# EAGLE schematic Jds-040-Usb-C (EAGLE 9.6.2)
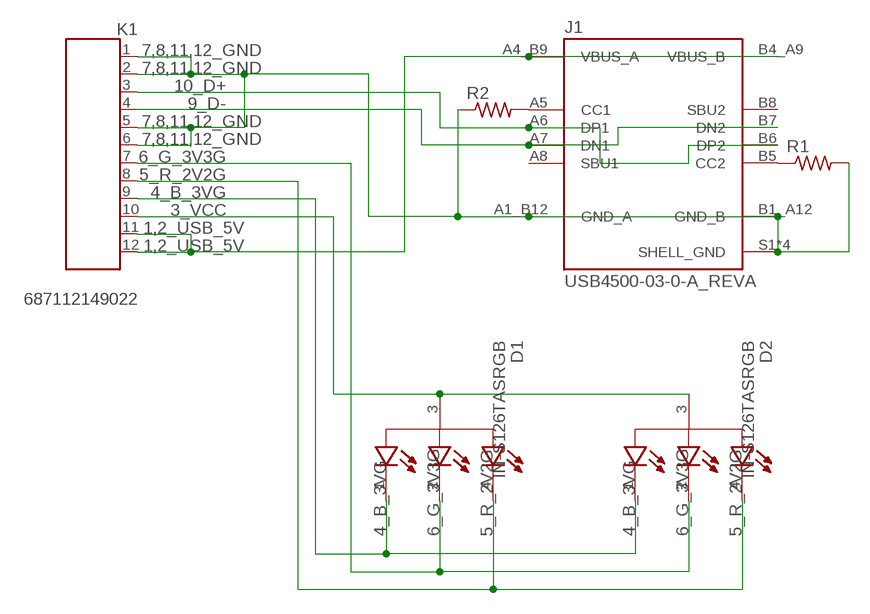
[diagram p0: schematic, sheet 1]

## Parts
D1  IN-S126TASRGB  [LED_IN-S126TASRGB]
D2  IN-S126TASRGB  [LED_IN-S126TASRGB]
J1  USB4500-03-0-A_REVA  [GCT_USB4500-03-0-A_REVA]
K1  687112149022  [687112149022]
R1  5k1  RC0603JR-070RL  [RES_0603]
R2  5k1  RC0603JR-070RL  [RES_0603]

## Nets
1,2_USB_5V: J1.A4_B9(VBUS_A) J1.B4_A9(VBUS_B) K1.11 K1.12
3_VCC: D1.3(COM+) D2.3(COM+) K1.10
4_B_3VG: D1.1(B) D2.1(B) K1.9
5_R_2V2G: D1.4(R) D2.4(R) K1.8
6_G_3V3G: D1.2(G) D2.2(G) K1.7
7,8,11,12_GND: J1.A1_B12(GND_A) J1.B1_A12(GND_B) J1.S1(SHELL_GND) J1.S2(SHELL_GND) J1.S3(SHELL_GND) J1.S4(SHELL_GND) K1.1 K1.2 K1.5 K1.6 R1.2 R2.1
9_D-: J1.A7(DN1) J1.B7(DN2) K1.4
10_D+: J1.A6(DP1) J1.B6(DP2) K1.3
N$1: J1.B5(CC2) R1.1
N$2: J1.A5(CC1) R2.2
Unconnected: J1.A8(SBU1) J1.B8(SBU2)

## Library data of the parts
D1 D2 = IN-S126TASRGB:IN-S126TASRGB: LED RGB CLEAR 1206 SMD R/A Check availability <https://pricing.snapeda.com/parts/IN-S126TASRGB/Inolux/view-part?ref=eda>; AVAILABILITY: In Stock; CHECK_PRICES: https://www.snapeda.com/parts/IN-S126TASRGB/Inolux/view-part/?ref=eda; DESCRIPTION: Red, Green, Blue (RGB) - LED Indication - Discrete 1.6V Red, 2.8V Green, 2.8V Blue 4-SMD; MF: Inolux; MP: IN-S126TASRGB; PACKAGE: 1206 Inolux; PRICE: None; PURCHASE-URL: https://pricing.snapeda.com/search?q=IN-S126TASRGB&ref=eda; SNAPEDA_LINK: https://www.snapeda.com/parts/IN-S126TASRGB/Inolux/view-part/?ref=snap
J1 = USB4500-03-0-A_REVA:USB4500-03-0-A_REVA: Check availability <https://pricing.snapeda.com/parts/USB4500-03-0-A/Global%20Connector%20Technology/view-part?ref=eda>; AVAILABILITY: In Stock; DESCRIPTION: USB-C (USB TYPE-C) USB 2.0 Receptacle Connector 24 (16+8 Dummy) Position Board Edge, Cutout; Surface Mount; Through Hole, Right Angle; MF: Global Connector Technology; MP: USB4500-03-0-A; PACKAGE: None; PRICE: None
K1 = FPC_Connectors_Flat_Flexible_Cable_rev15c:687112149022: WR-FPC 0.50mm SMT Horiz. Bot. Contact Hinge type WR-FPC 0.50mm 12 pins Hinge type SMT Horizontal Bottom Contact ;=>Code : Con_FPC_ZIF_0.50_6871xx149022_687112149022 <http://katalog.we-online.de/media/images/eican/Con_FPC_ZIF_0.50_687115149022_pf2.jpg> Details see: http://katalog.we-online.de/em/datasheet/6871xx149022.pdf Created 2014-10-08, Karrer Zheng 2014 (C) Wurth Elektronik
R1 R2 = Resistor_Capacitor:RC0603JR-070RL: RES SMD 0 OHM JUMPER 1/10W 0603 Manufacturer's datasheet <http://www.yageo.com/documents/recent/PYu-RC_Group_51_RoHS_L_10.pdf>; CREATED_BY: PCBLayout.com; DIGIKEY_PART_NUMBER: 311-0.0GRTR-ND; MANUFACTURER: Yageo; MPN: RC0603JR-070RL; PACKAGE: SMD 0603